# EAGLE design Pog (EAGLE 8.6.3)
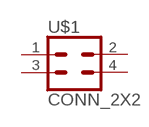
[diagram p0: schematic, sheet 1]

## Parts
U$1  CONN_2X2  [2X2_SMD]
Unconnected: U$1.1 U$1.2 U$1.3 U$1.4

## Library data of the parts
U$1 = SparkFun-Connectors:CONN_2X2

## Board
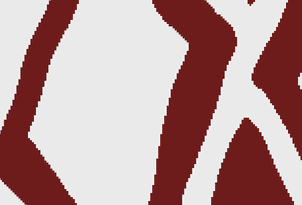
[diagram p1: board, top side]
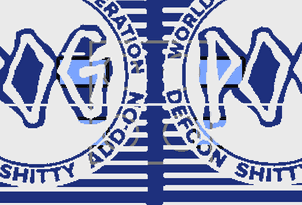
[diagram p2: board, bottom side, seen from below]

No outline drawn. Coordinates in mm, seen from the top.
Copper layers (1*16): Top 0.035mm / dielectric 1.5mm / Bottom 0.035mm
Design rules "default": minimum track width 6mil, minimum drill 0.35mm, track to track 6mil, track to pad 6mil, pad to pad 6mil, via to via 6mil, smd to smd 6mil, copper to edge 40mil, drill to drill 6mil, minimum pad ring 10mil, minimum via ring 8mil, stop-mask expansion 4mil, vias tented up to drill 0mil, thermal gap 10mil
Milling: area 0,-0.3 to 44.5,44.2

### Footprints (pad centres in the part's own frame; a part is rotated, then mirrored left to right if it is on the bottom)
2X2_SMD = smd 1.02 x 1.9: 1 -1.27,-2.85; 2 -1.27,2.85; 3 1.27,-2.85; 4 1.27,2.85

### Placement (x,y rotation side)
U$1  22.1,22.01 270 bottom

### Tracks (layer width: path | path; a pad name or v marks a point on that pad's centre or on a via)
N$1
  pour Top: 0.08,21.84 arc-90 22.43,44.19 22.6,44.19 arc-90 44.53,22.27 44.53,21.76 arc-90 22.43,-0.34 21.93,-0.34 arc-90 0.08,21.5
N$2
  pour Bottom: 0,21.67 0,21.93 arc-90 22.27,44.19 22.35,44.19 arc-90 44.61,21.93 arc-90 22.35,-0.34 22.01,-0.34 arc-90